# Altium schematic sheet Microcontroller.SchDoc: Microcontroller
size Tabloid; DocumentNumber: 2; Revision: 0.4b; SheetNumber: 2; SheetTotal: 11
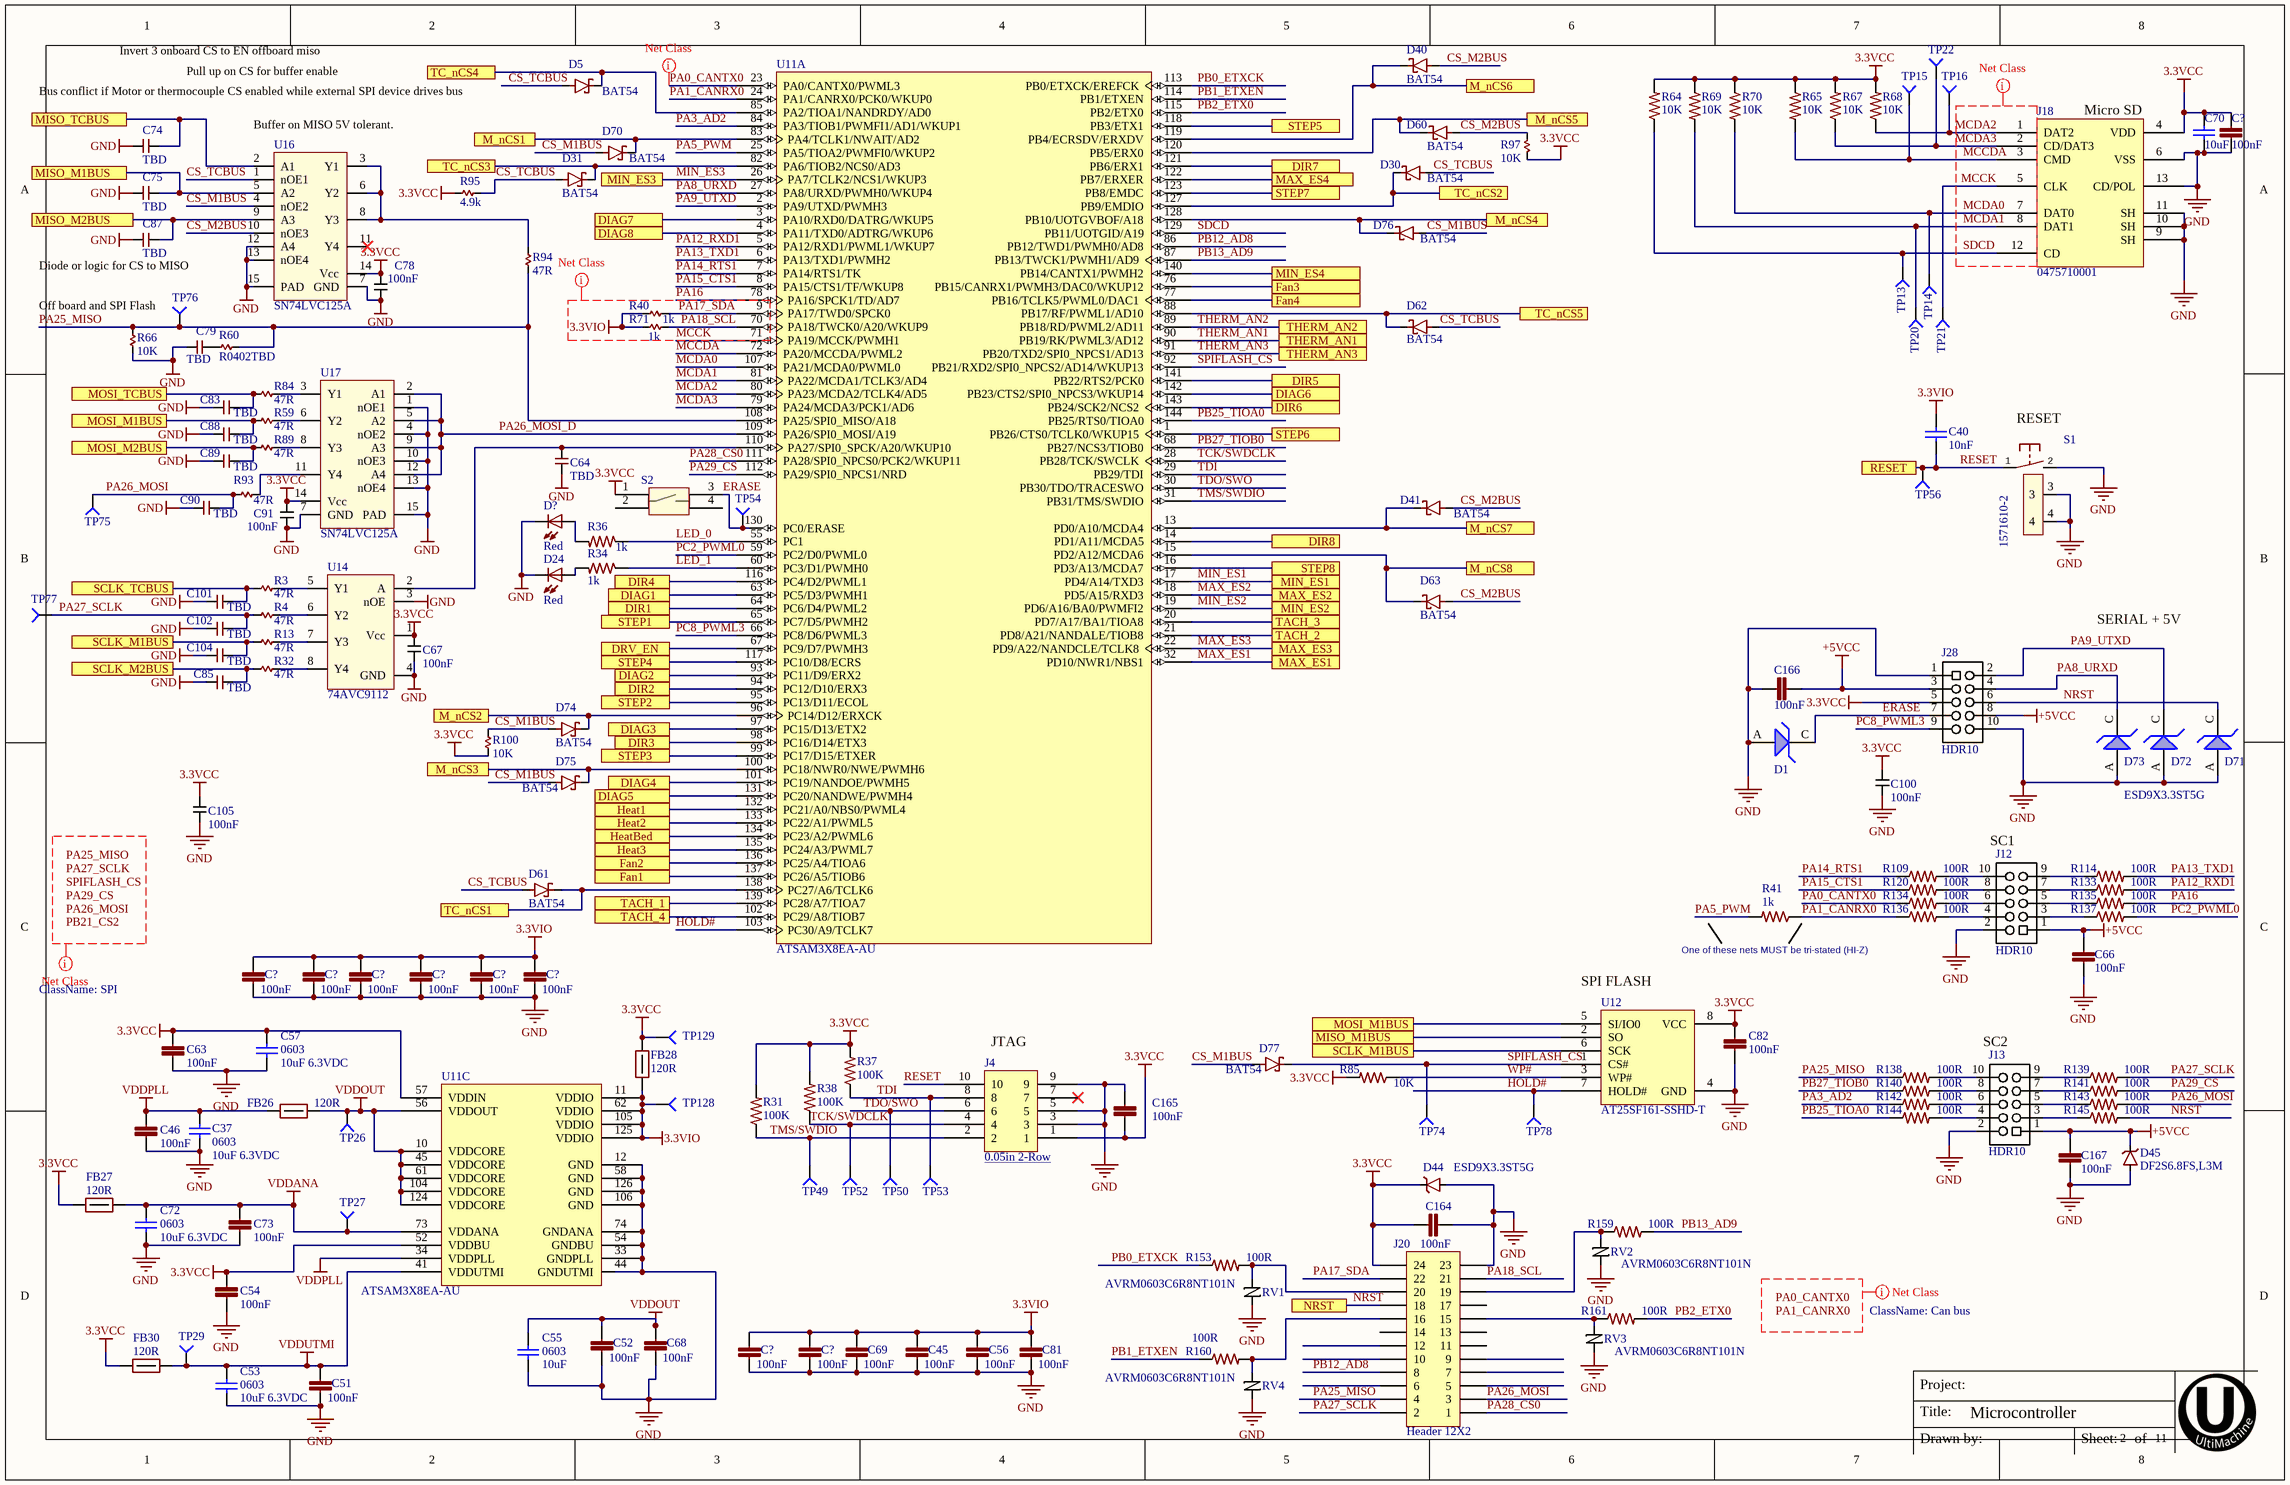
[diagram p0: Microcontroller.SchDoc]

## Parts
(Parts that share a designator on the sheet are numbered #1, #2 ... from top to bottom, then left to right.)
C37  0603  value 10uF 6.3VDC  [C0603]
C40  10nF  [C0402]
C45  100nF  [C0402]
C46  100nF  [C0402]
C51  100nF  [C0402]
C52  100nF  [C0402]
C53  0603  value 10uF 6.3VDC  [C0603]
C54  100nF  [C0402]
C55  0603  value 10uF  [C0603]
C56  100nF  [C0402]
C57  0603  value 10uF 6.3VDC  [C0603]
C63  100nF  [C0402]
C64  TBD  [C0402]
C66  100nF  [C0402]
C67  100nF  [C0201 Large Pads]
C68  100nF  [C0402]
C69  100nF  [C0402]
C70  value 10uF  [C0603]  (hidden comment: 0603)
C72  0603  value 10uF 6.3VDC  [C0603]
C73  100nF  [C0402]
C74  TBD  [C0402]
C75  TBD  [C0402]
C78  100nF  [C0201 Large Pads]
C79  TBD  [C0402]
C81  100nF  [C0402]
C82  100nF  [C0402]
C83  TBD  [C0402]
C85  TBD  [C0402]
C87  TBD  [C0402]
C88  TBD  [C0402]
C89  TBD  [C0402]
C90  TBD  [C0402]
C91  100nF  [C0201 Large Pads]
C100  100nF  [C0201 Large Pads]
C101  TBD  [C0402]
C102  TBD  [C0402]
C104  TBD  [C0402]
C105  100nF  [C0201 Large Pads]
C164  100nF  [C0402]
C165  100nF  [C0402]
C166  100nF  [C0402]
C167  100nF  [C0402]
C?#1  100nF  [C0402]
C?#2  100nF  [C0402]
C?#3  100nF  [C0402]
C?#4  100nF  [C0402]
C?#5  100nF  [C0402]
C?#6  100nF  [C0402]
C?#7  100nF  [C0402]
C?#8  100nF  [C0402]
C?#9  100nF  [C0402]
D1  ESD9X3.3ST5G  [SOD923-100X40-2N]  (value not drawn)
D5  BAT54  [SOD523_IPC]
D24  Red  [LED2012120]
D30  BAT54  [SOD523_IPC]
D31  BAT54  [SOD523_IPC]
D40  BAT54  [SOD523_IPC]
D41  BAT54  [SOD523_IPC]
D44  ESD9X3.3ST5G  [SOD923-D]
D45  DF2S6.8FS,L3M  [SOD923-D]
D60  BAT54  [SOD523_IPC]
D61  BAT54  [SOD523_IPC]
D62  BAT54  [SOD523_IPC]
D63  BAT54  [SOD523_IPC]
D70  BAT54  [SOD523_IPC]
D71  ESD9X3.3ST5G  [SOD923-100X40-2N]
D72  ESD9X3.3ST5G  [SOD923-100X40-2N]  (value not drawn)
D73  ESD9X3.3ST5G  [SOD923-100X40-2N]  (value not drawn)
D74  BAT54  [SOD523_IPC]
D75  BAT54  [SOD523_IPC]
D76  BAT54  [SOD523_IPC]
D77  BAT54  [SOD523_IPC]
D?  Red  [LED2012120]
FB26  120R  [FB0603]
FB27  120R  [FB0603]
FB28  120R  [FB0603]
FB30  120R  [FB0603]
J4  0.05in 2-Row  [FTSH-105-XX-X-DV]
J12  HDR10  [HDR2X5 IDC]
J13  HDR10  [HDR2X5 IDC]
J18  0475710001  [SD_MICRO 475710001]
J20  Header 12X2  [HDR2X12]
J28  HDR10  [HDR2X5 IDC]
R3  47R  [R0402]
R4  47R  [R0402]
R13  47R  [R0402]
R31  100K  [R0402]
R32  47R  [R0402]
R34  1k  [R0402]
R36  1k  [R0402]
R37  100K  [R0402]
R38  100K  [R0402]
R40  1k  [R0402]
R41  1k  [R0402]
R59  47R  [R0402]
R60  R0402TBD  [R0402]
R64  10K  [R0402]
R65  10K  [R0402]
R66  10K  [R0402]
R67  10K  [R0402]
R68  10K  [R0402]
R69  10K  [R0402]
R70  10K  [R0402]
R71  1k  [R0402]
R84  47R  [R0402]
R85  10K  [R0402]
R89  47R  [R0402]
R93  47R  [R0402]
R94  47R  [R0402]
R95  4.9k  [R0402]
R97  10K  [R0402]
R100  10K  [R0402]
R109  100R  [R0402]
R114  100R  [R0402]
R120  100R  [R0402]
R133  100R  [R0402]
R134  100R  [R0402]
R135  100R  [R0402]
R136  100R  [R0402]
R137  100R  [R0402]
R138  100R  [R0402]
R139  100R  [R0402]
R140  100R  [R0402]
R141  100R  [R0402]
R142  100R  [R0402]
R143  100R  [R0402]
R144  100R  [R0402]
R145  100R  [R0402]
R153  100R  [R0402]
R159  100R  [R0402]
R160  100R  [R0402]
R161  100R  [R0402]
RV1  AVRM0603C6R8NT101N  [C0201 Large Pads]
RV2  AVRM0603C6R8NT101N  [C0201 Large Pads]
RV3  AVRM0603C6R8NT101N  [C0201 Large Pads]
RV4  AVRM0603C6R8NT101N  [C0201 Large Pads]
S1  1571610-2  [B3F-31XX]
S2  KMR741NG ULC LFS  [KMR 6 Series]  (value not drawn)
TP13  TP4  [TP-2]  (value not drawn)  (no BOM)
TP14  TP4  [TP-2]  (value not drawn)  (no BOM)
TP15  TP4  [TP-2]  (value not drawn)  (no BOM)
TP16  TP4  [TP-2]  (value not drawn)  (no BOM)
TP20  TP4  [TP-2]  (value not drawn)  (no BOM)
TP21  TP4  [TP-2]  (value not drawn)  (no BOM)
TP22  TP4  [TP-2]  (value not drawn)  (no BOM)
TP26  TP4  [TP-2]  (value not drawn)  (no BOM)
TP27  TP4  [TP-2]  (value not drawn)  (no BOM)
TP29  TP4  [TP-2]  (value not drawn)  (no BOM)
TP49  TP4  [TP-2]  (value not drawn)  (no BOM)
TP50  TP4  [TP-2]  (value not drawn)  (no BOM)
TP52  TP4  [TP-2]  (value not drawn)  (no BOM)
TP53  TP4  [TP-2]  (value not drawn)  (no BOM)
TP54  TP4  [TP-2]  (value not drawn)  (no BOM)
TP56  TP4  [TP-2]  (value not drawn)  (no BOM)
TP74  TP4  [TP-2]  (value not drawn)  (no BOM)
TP75  TP4  [TP-2]  (value not drawn)  (no BOM)
TP76  TP4  [TP-2]  (value not drawn)  (no BOM)
TP77  TP4  [TP-2]  (value not drawn)  (no BOM)
TP78  TP4  [TP-2]  (value not drawn)  (no BOM)
TP128  TP4  [TP-2]  (value not drawn)  (no BOM)
TP129  TP4  [TP-2]  (value not drawn)  (no BOM)
U11#1  ATSAM3X8EA-AU  [LQFP144_N]  (part A of 3)
U11#2  ATSAM3X8EA-AU  [LQFP144_N]  (part C of 3)
U12  AT25SF161-SSHD-T  [S25FL216K0PMFI041]
U14  74AVC9112  [XSON50P100X50-8L]
U16  SN74LVC125A  [PVQFN14_3.5X3.5]
U17  SN74LVC125A  [PVQFN14_3.5X3.5]

## Ports
DIAG1, DIAG2, DIAG3, DIAG4, DIAG5, DIAG6, DIAG7, DIAG8, DIR1, DIR2, DIR3, DIR4, DIR5, DIR6, DIR7, DIR8, DRV_EN, Fan1, Fan2, Fan3, Fan4, Heat1, Heat2, Heat3, HeatBed, M_nCS1, M_nCS2, M_nCS3, M_nCS4, M_nCS5, M_nCS6, M_nCS7, M_nCS8, MAX_ES1, MAX_ES2, MAX_ES3, MAX_ES4, MIN_ES1, MIN_ES2, MIN_ES3, MIN_ES4, MISO_M1BUS, MISO_M2BUS, MISO_TCBUS, MOSI_M1BUS, MOSI_M2BUS, MOSI_TCBUS, NRST, RESET, SCLK_M1BUS, SCLK_M2BUS, SCLK_TCBUS, STEP1, STEP2, STEP3, STEP4, STEP5, STEP6, STEP7, STEP8, TACH_1, TACH_2, TACH_3, TACH_4, TC_nCS1, TC_nCS2, TC_nCS3, TC_nCS4, TC_nCS5, THERM_AN1, THERM_AN2, THERM_AN3

## Nets
3.3VCC: C54.1 C57.2 C63.1 C67.2 C70.2 C78.2 C82.1 C91.2 C100.2 C105.2 C164.1 C165.2 C?#1.1 D44.K FB27.1 FB28.2 FB30.1 J4.1 J18.4(VDD) J20.24 J28.5 R31.2 R37.2 R38.2 R64.2 R65.1 R67.2 R68.2 R69.1 R70.1 R85.2 R95.1 R97.1 R100.1 S2.1 TP129.1 U11#2.52(VDDBU) U11#2.57(VDDIN) U12.8(VCC) U14.1(Vcc) U16.14(Vcc) U17.14(Vcc)
3.3VIO: C40.2 C45.1 C56.1 C69.1 C81.1 C?#2.1 C?#3.1 C?#4.1 C?#5.1 C?#6.1 C?#7.1 C?#8.1 C?#9.1 FB28.1 R40.1 R71.1 TP128.1 U11#2.11(VDDIO) U11#2.62(VDDIO) U11#2.105(VDDIO) U11#2.125(VDDIO)
+5VCC: C66.2 C166.1 C167.2 D45.K J12.1 J13.1 J28.3 J28.8
GND: C37.1 C45.2 C46.2 C51.2 C52.2 C53.1 C54.2 C55.1 C56.2 C57.1 C63.2 C64.1 C66.1 C67.1 C68.2 C69.2 C70.1 C72.1 C73.2 C74.2 C75.2 C78.1 C79.2 C81.2 C82.2 C83.2 C85.1 C87.2 C88.2 C89.2 C90.2 C91.1 C100.1 C101.1 C102.1 C104.1 C105.1 C164.2 C165.1 C166.2 C167.1 C?#1.2 C?#2.2 C?#3.2 C?#4.2 C?#5.2 C?#6.2 C?#7.2 C?#8.2 C?#9.2 D1.A D24.C D44.A D45.A D71.A D72.A D73.A D?.C J4.3 J4.5 J4.9 J12.2 J13.2 J18.6(VSS) J18.9(SH) J18.10(SH) J18.11(SH) J18.13(CD/POL) J20.23 J28.1 J28.10 R66.1 RV1.2 RV2.2 RV3.2 RV4.2 S1.2(S) S1.3 S1.4 U11#2.12(GND) U11#2.33(GNDPLL) U11#2.44(GNDUTMI) U11#2.54(GNDBU) U11#2.58(GND) U11#2.74(GNDANA) U11#2.106(GND) U11#2.126(GND) U12.4(GND) U14.3(nOE) U14.4(GND) U16.7(GND) U16.12(A4) U16.13(nOE4) U16.15(PAD) U17.1(nOE1) U17.4(nOE2) U17.7(GND) U17.10(nOE3) U17.13(nOE4) U17.15(PAD)
VDDANA: C72.2 C73.1 FB27.2 TP27.1 U11#2.73(VDDANA)
VDDOUT: C52.1 C55.2 C68.1 FB26.2 TP26.1 U11#2.10(VDDCORE) U11#2.45(VDDCORE) U11#2.56(VDDOUT) U11#2.61(VDDCORE) U11#2.104(VDDCORE) U11#2.124(VDDCORE)
VDDPLL: C37.2 C46.1 FB26.1 U11#2.34(VDDPLL)
VDDUTMI: C51.1 C53.2 FB30.2 TP29.1 U11#2.41(VDDUTMI)
CS_M1BUS: D70.A D74.A D75.A D76.A D77.A R100.2 U16.4(nOE2)
CS_M2BUS: D40.A D41.A D60.A D63.A R97.2 U16.10(nOE3)
CS_TCBUS: D5.A D30.A D31.A D61.A D62.A R95.2 U16.1(nOE1)
DIAG1: U11#1.63(PC5/D3/PWMH1) ; port DIAG1
DIAG2: U11#1.93(PC11/D9/ERX2) ; port DIAG2
DIAG3: U11#1.97(PC15/D13/ETX2) ; port DIAG3
DIAG4: U11#1.101(PC19/NANDOE/PWMH5) ; port DIAG4
DIAG5: U11#1.131(PC20/NANDWE/PWMH4) ; port DIAG5
DIAG6: U11#1.142(PB23/CTS2/SPI0_NPCS3/WKUP14) ; port DIAG6
DIAG7: U11#1.3(PA10/RXD0/DATRG/WKUP5) ; port DIAG7
DIAG8: U11#1.4(PA11/TXD0/ADTRG/WKUP6) ; port DIAG8
DIR1: U11#1.64(PC6/D4/PWML2) ; port DIR1
DIR2: U11#1.94(PC12/D10/ERX3) ; port DIR2
DIR3: U11#1.98(PC16/D14/ETX3) ; port DIR3
DIR4: U11#1.116(PC4/D2/PWML1) ; port DIR4
DIR5: U11#1.141(PB22/RTS2/PCK0) ; port DIR5
DIR6: U11#1.143(PB24/SCK2/NCS2) ; port DIR6
DIR7: U11#1.121(PB6/ERX1) ; port DIR7
DIR8: U11#1.14(PD1/A11/MCDA5) ; port DIR8
DRV_EN: U11#1.67(PC9/D7/PWMH3) ; port DRV_EN
ERASE: D1.C J28.7 S2.3 TP54.1 U11#1.130(PC0/ERASE)
Fan1: U11#1.137(PC26/A5/TIOB6) ; port Fan1
Fan2: U11#1.136(PC25/A4/TIOA6) ; port Fan2
Fan3: U11#1.76(PB15/CANRX1/PWMH3/DAC0/WKUP12) ; port Fan3
Fan4: U11#1.77(PB16/TCLK5/PWML0/DAC1) ; port Fan4
Heat1: U11#1.132(PC21/A0/NBS0/PWML4) ; port Heat1
Heat2: U11#1.133(PC22/A1/PWML5) ; port Heat2
Heat3: U11#1.135(PC24/A3/PWML7) ; port Heat3
HeatBed: U11#1.134(PC23/A2/PWML6) ; port HeatBed
HOLD#: TP78.1 U11#1.103(PC30/A9/TCLK7) U12.7(HOLD#)
LED_0: R36.1 U11#1.55(PC1)
LED_1: R34.1 U11#1.60(PC3/D1/PWMH0)
M_nCS1: D70.K U11#1.83(PA4/TCLK1/NWAIT/AD2) ; port M_nCS1
M_nCS2: D74.K U11#1.96(PC14/D12/ERXCK) ; port M_nCS2
M_nCS3: D75.K U11#1.100(PC18/NWR0/NWE/PWMH6) ; port M_nCS3
M_nCS4: D76.K U11#1.128(PB10/UOTGVBOF/A18) ; port M_nCS4
M_nCS5: D60.K U11#1.120(PB5/ERX0) ; port M_nCS5
M_nCS6: D40.K U11#1.119(PB4/ECRSDV/ERXDV) ; port M_nCS6
M_nCS7: D41.K U11#1.13(PD0/A10/MCDA4) ; port M_nCS7
M_nCS8: D63.K U11#1.15(PD2/A12/MCDA6) ; port M_nCS8
MAX_ES1: U11#1.32(PD10/NWR1/NBS1) ; port MAX_ES1
MAX_ES2: U11#1.18(PD5/A15/RXD3) ; port MAX_ES2
MAX_ES3: U11#1.22(PD9/A22/NANDCLE/TCLK8) ; port MAX_ES3
MAX_ES4: U11#1.122(PB7/ERXER) ; port MAX_ES4
MCCDA: J18.3(CMD) R65.2 TP15.1 U11#1.72(PA20/MCCDA/PWML2)
MCCK: J18.5(CLK) TP21.1 U11#1.71(PA19/MCCK/PWMH1)
MCDA0: J18.7(DAT0) R70.2 TP14.1 U11#1.107(PA21/MCDA0/PWML0)
MCDA1: J18.8(DAT1) R69.2 TP20.1 U11#1.81(PA22/MCDA1/TCLK3/AD4)
MCDA2: J18.1(DAT2) R68.1 TP16.1 U11#1.80(PA23/MCDA2/TCLK4/AD5)
MCDA3: J18.2(CD/DAT3) R67.1 TP22.1 U11#1.79(PA24/MCDA3/PCK1/AD6)
MIN_ES1: U11#1.17(PD4/A14/TXD3) ; port MIN_ES1
MIN_ES2: U11#1.19(PD6/A16/BA0/PWMFI2) ; port MIN_ES2
MIN_ES3: U11#1.26(PA7/TCLK2/NCS1/WKUP3) ; port MIN_ES3
MIN_ES4: U11#1.140(PB14/CANTX1/PWMH2) ; port MIN_ES4
MISO_M1BUS: C75.1 U12.2(SO) U16.5(A2) ; port MISO_M1BUS
MISO_M2BUS: C87.1 U16.9(A3) ; port MISO_M2BUS
MISO_TCBUS: C74.1 U16.2(A1) ; port MISO_TCBUS
MOSI_M1BUS: C88.1 R59.1 U12.5(SI/IO0) ; port MOSI_M1BUS
MOSI_M2BUS: C89.1 R89.1 ; port MOSI_M2BUS
MOSI_TCBUS: C83.1 R84.1 ; port MOSI_TCBUS
NRST: D71.C J20.18 J28.6 R145.2 ; port NRST
PA0_CANTX0: R134.1 U11#1.23(PA0/CANTX0/PWML3)
PA1_CANRX0: R41.1 R136.1 U11#1.24(PA1/CANRX0/PCK0/WKUP0)
PA3_AD2: R142.1 U11#1.84(PA3/TIOB1/PWMFI1/AD1/WKUP1)
PA5_PWM: R41.2 U11#1.25(PA5/TIOA2/PWMFI0/WKUP2)
PA8_URXD: D73.C J28.4 U11#1.27(PA8/URXD/PWMH0/WKUP4)
PA9_UTXD: D72.C J28.2 U11#1.2(PA9/UTXD/PWMH3)
PA12_RXD1: R133.2 U11#1.5(PA12/RXD1/PWML1/WKUP7)
PA13_TXD1: R114.2 U11#1.6(PA13/TXD1/PWMH2)
PA14_RTS1: R109.1 U11#1.7(PA14/RTS1/TK)
PA15_CTS1: R120.1 U11#1.8(PA15/CTS1/TF/WKUP8)
PA16: R135.2 U11#1.78(PA16/SPCK1/TD/AD7)
PA17_SDA: J20.22 R40.2 U11#1.9(PA17/TWD0/SPCK0)
PA18_SCL: J20.21 R71.2 U11#1.70(PA18/TWCK0/A20/WKUP9)
PA25_MISO: J20.4 R60.2 R66.2 R94.1 R138.1 TP76.1 U11#1.108(PA25/SPI0_MISO/A18)
PA26_MOSI: C90.1 J20.3 R93.1 R143.2 TP75.1
PA26_MOSI_D: U11#1.109(PA26/SPI0_MOSI/A19) U17.2(A1) U17.5(A2) U17.9(A3) U17.12(A4)
PA27_SCLK: C102.2 J20.2 R4.1 R139.2 TP77.1
PA28_CS0: J20.1 U11#1.111(PA28/SPI0_NPCS0/PCK2/WKUP11)
PA29_CS: R141.2 U11#1.112(PA29/SPI0_NPCS1/NRD)
PB0_ETXCK: R153.1 U11#1.113(PB0/ETXCK/EREFCK)
PB1_ETXEN: R160.1 U11#1.114(PB1/ETXEN)
PB2_ETX0: R161.2 U11#1.115(PB2/ETX0)
PB12_AD8: J20.8 U11#1.86(PB12/TWD1/PWMH0/AD8)
PB13_AD9: R159.2 U11#1.87(PB13/TWCK1/PWMH1/AD9)
PB25_TIOA0: R144.1 U11#1.144(PB25/RTS0/TIOA0)
PB27_TIOB0: R140.1 U11#1.68(PB27/NCS3/TIOB0)
PC2_PWML0: R137.2 U11#1.59(PC2/D0/PWML0)
PC8_PWML3: J28.9 U11#1.66(PC8/D6/PWML3)
RESET: C40.1 J4.10 S1.1(P) TP56.1 ; port RESET
SCLK_M1BUS: C104.2 R13.1 U12.6(SCK) ; port SCLK_M1BUS
SCLK_M2BUS: C85.2 R32.1 ; port SCLK_M2BUS
SCLK_TCBUS: C101.2 R3.1 ; port SCLK_TCBUS
SDCD: J18.12(CD) R64.1 TP13.1 U11#1.129(PB11/UOTGID/A19)
SPIFLASH_CS: D77.K TP74.1 U11#1.92(PB21/RXD2/SPI0_NPCS2/AD14/WKUP13) U12.1(CS#)
STEP1: U11#1.65(PC7/D5/PWMH2) ; port STEP1
STEP2: U11#1.95(PC13/D11/ECOL) ; port STEP2
STEP3: U11#1.99(PC17/D15/ETXER) ; port STEP3
STEP4: U11#1.117(PC10/D8/ECRS) ; port STEP4
STEP5: U11#1.118(PB3/ETX1) ; port STEP5
STEP6: U11#1.1(PB26/CTS0/TCLK0/WKUP15) ; port STEP6
STEP7: U11#1.123(PB8/EMDC) ; port STEP7
STEP8: U11#1.16(PD3/A13/MCDA7) ; port STEP8
TACH_1: U11#1.139(PC28/A7/TIOA7) ; port TACH_1
TACH_2: U11#1.21(PD8/A21/NANDALE/TIOB8) ; port TACH_2
TACH_3: U11#1.20(PD7/A17/BA1/TIOA8) ; port TACH_3
TACH_4: U11#1.102(PC29/A8/TIOB7) ; port TACH_4
TC_nCS1: D61.K U11#1.138(PC27/A6/TCLK6) ; port TC_nCS1
TC_nCS2: D30.K U11#1.127(PB9/EMDIO) ; port TC_nCS2
TC_nCS3: D31.K U11#1.82(PA6/TIOB2/NCS0/AD3) ; port TC_nCS3
TC_nCS4: D5.K U11#1.85(PA2/TIOA1/NANDRDY/AD0) ; port TC_nCS4
TC_nCS5: D62.K U11#1.88(PB17/RF/PWML1/AD10) ; port TC_nCS5
TCK/SWDCLK: J4.4 R38.1 TP52.1 U11#1.28(PB28/TCK/SWCLK)
TDI: J4.8 R37.1 TP53.1 U11#1.29(PB29/TDI)
TDO/SWO: J4.6 TP50.1 U11#1.30(PB30/TDO/TRACESWO)
THERM_AN1: U11#1.90(PB19/RK/PWML3/AD12) ; port THERM_AN1
THERM_AN2: U11#1.89(PB18/RD/PWML2/AD11) ; port THERM_AN2
THERM_AN3: U11#1.91(PB20/TXD2/SPI0_NPCS1/AD13) ; port THERM_AN3
TMS/SWDIO: J4.2 R31.1 TP49.1 U11#1.31(PB31/TMS/SWDIO)
WP#: R85.1 U12.3(WP#)
NetC64_2: C64.2 U11#1.110(PA27/SPI0_SPCK/A20/WKUP10) U14.2(A)
NetC79_1: C79.1 R60.1
NetD24_A: D24.A R34.2
NetD?_A: D?.A R36.2
NetJ12_3: J12.3 R137.1
NetJ12_4: J12.4 R136.2
NetJ12_5: J12.5 R135.1
NetJ12_6: J12.6 R134.2
NetJ12_7: J12.7 R133.1
NetJ12_8: J12.8 R120.2
NetJ12_9: J12.9 R114.1
NetJ12_10: J12.10 R109.2
NetJ13_3: J13.3 R145.1
NetJ13_4: J13.4 R144.2
NetJ13_5: J13.5 R143.1
NetJ13_6: J13.6 R142.2
NetJ13_7: J13.7 R141.1
NetJ13_8: J13.8 R140.2
NetJ13_9: J13.9 R139.1
NetJ13_10: J13.10 R138.2
NetJ20_15: J20.15 R161.1 RV3.1
NetJ20_16: J20.16 R160.2 RV4.1
NetJ20_19: J20.19 R159.1 RV2.1
NetJ20_20: J20.20 R153.2 RV1.1
NetR3_2: R3.2 U14.5(Y1)
NetR4_2: R4.2 U14.6(Y2)
NetR13_2: R13.2 U14.7(Y3)
NetR32_2: R32.2 U14.8(Y4)
NetR59_2: R59.2 U17.6(Y2)
NetR84_2: R84.2 U17.3(Y1)
NetR89_2: R89.2 U17.8(Y3)
NetR93_2: R93.2 U17.11(Y4)
NetR94_2: R94.2 U16.3(Y1) U16.6(Y2) U16.8(Y3)

Not connected (* = marked no-connect by the designer): J4 7*; J20 5 6 7 9 10 11 12 13 14 17; S2 2 4; U14 23(NC); U16 11(Y4)* 23(NC); U17 23(NC)

## Layout directives
net class SD: MCCDA, MCCK, MCDA0, MCDA1, SDCD
net class Can bus: PA0_CANTX0, PA1_CANRX0
net class SPI: PA25_MISO, PA26_MOSI, PA27_SCLK, PA29_CS, PB21_CS2, SPIFLASH_CS
net class SERIAL: 3.3VIO, MCCK, PA16, PA17_SDA, PA18_SCL
net class CANBUS: PA0_CANTX0

## Notes on the sheet
- (near D5) Bus conflict if Motor or thermocouple CS enabled while external SPI device drives bus
- Invert 3 onboard CS to EN offboard miso
- Pull up on CS for buffer enable
- (near U16) Buffer on MISO 5V tolerant.
- (near J18) Micro SD
- (near C87) Diode or logic for CS to MISO
- (near TP76) Off board and SPI Flash
- (near S1) RESET
- SERIAL + 5V
- (near J12) SC1
- One of these nets MUST be tri-stated (HI-Z)
- (near U12) SPI FLASH
- (near J4) JTAG
- (near J13) SC2
- Labels drawn without touching a wire or pin: PA0_CANTX0, PA1_CANRX0, PA25_MISO, PA26_MOSI, PA27_SCLK, PA29_CS, PB21_CS2, SPIFLASH_CS
- Title:
- Project:
- Drawn by:
- Sheet:
- of

## Library data of the parts
C37 C53 C55 C57 C70 C72 = C1608JB0J106K080AB: CAP CER 10UF 6.3V 10% JB 0603; MANUFACTURER: TDK; EE_SPEC: 6.3VDC; PART DESCRIPTION: CAP CER 10UF 6.3V 10% JB 0603; TOLERANCE: 10%; MANUFACTURER #: C1608JB0J106K080AB; DISTRIBUTOR #: 445-11185-1-ND; DISTRIBUTOR: Digi-Key Electronics; PART: C1608JB0J106K080AB
C40 = GRM155R71H103JA88D: CAP CER 10nF 50V X7R 0402; PART DESCRIPTION: 10000pF ±5% 50V Ceramic Capacitor X7R 0402 (1005 Metric); MANUFACTURER: Murata; TOLERANCE: 5%; EE_SPEC: 50V; VALUE: 10nF; MANUFACTURER #: GRM155R71H103JA88D; DISTRIBUTOR #: 490-7763-1-ND; DISTRIBUTOR: Digi-Key Electronics; PART: GRM155R71H103JA88D
C45 C46 C51 C52 C54 C56 C63 C66 C68 C69 C73 C81 C82 C164-C167 C?#1-C?#9 = GRM155R71C104KA88D: CAP CER 0402 100nF 16V 10% X7R; MANUFACTURER: Murata; PART DESCRIPTION: 0.10µF ±10% 16V Ceramic Capacitor X7R 0402 (1005 Metric); EE_SPEC: 100nF 16V X7R 0402; VALUE: 100nF; MANUFACTURER #: GRM155R71C104KA88D; DISTRIBUTOR #: 490-3261-2-ND; DISTRIBUTOR: Digi-Key Electronics; PART: GRM155R71C104KA88D; TOLERANCE: 10%
C64 C74 C75 C79 C83 C85 C87-C90 C101 C102 C104 = C0402_TBD: CAP CER 0402 TBD; MANUFACTURER: TBD; VALUE: TBD; MANUFACTURER #: TBD; DISTRIBUTOR #: TBD; PART: TBD; PART DESCRIPTION: TBD; EE_SPEC: TBD
C67 C78 C91 = 100nF 6.3V X5R 0201: CAP CER 0.1UF 6.3V 10% X5R 0201; MANUFACTURER: Samsung; MANUFACTURER #: CL03A104KQ3NNNC; VALUE: 100nF; DISTRIBUTOR: DIGI-KEY; DISTRIBUTOR #: 1276-1013-1-ND; TOLERANCE: 10%; VOLTAGE: 6.3V; PART: CL03A104KQ3NNNC
C100 C105 = 100nF 6.3V X5R 0201: CAP CER 0.1UF 6.3V 10% X5R 0201; PART: CL03A104KQ3NNNC; MANUFACTURER: Samsung; MANUFACTURER #: CL03A104KQ3NNNC; DISTRIBUTOR: DIGI-KEY; DISTRIBUTOR #: 1276-1013-1-ND; TOLERANCE: 10%; VOLTAGE: 6.3V
D1 D44 D71-D73 = ESD9X3.3ST5G: TVS DIODE 3.3VWM 10.4VC SOD923; MANUFACTURER: On Semi; PART DESCRIPTION: TVS DIODE 3.3VWM SOD923; TOLERANCE: -NA-; VALUE: 3.3V; EE_SPEC: 3.3Vso 15pF; MANUFACTURER #: ESD9X3.3ST5G; DISTRIBUTOR #: ESD9X3.3ST5GOSCT-ND; PART: ESD9X3.3ST5G
  D1 D71-D73: DISTRIBUTOR: Digi-Key Electronics
  D44: DISTRIBUTOR: Digikey
D5 D30 D31 D40 D41 D60-D63 D70 D74-D77 = BAT54WX: DIODE SCHOTTKY 30V 200MA SOD523; MANUFACTURER: Diodes Incorporated; MANUFACTURER #: BAT54WX-TP; PART DESCRIPTION: Diode Schottky 30V 200mA (DC) Surface Mount SOD-523; TOLERANCE: -NA-; VALUE: BAT54; DISTRIBUTOR #: BAT54WX-TPTR-ND; DISTRIBUTOR: Digi-Key Electronics; PART: BAT54WX-TP; EE_SPEC: 30V 200mA
D24 D? = 5988110107F: LED 0805 Red; MANUFACTURER: Dialight; PART DESCRIPTION: Red 635nm LED Indication - Discrete 2.2V 0805 (2012 Metric); TOLERANCE: -NA-; EE_SPEC: Vf=2.2V; VALUE: Red; MANUFACTURER #: 5988110107F; DISTRIBUTOR #: 350-2038-2-ND; DISTRIBUTOR: Digi-Key Electronics; PART: 5988110107F
D45 = DF2S6.8FS,L3M: TVS DIODE 5V 9V SOD923; MANUFACTURER: Toshiba; EE_SPEC: 5Vso; MANUFACTURER #: DF2S6.8FS,L3M; PART DESCRIPTION: TVS DIODE 5V 9V SOD923; VALUE: 5V; PART: DF2S6.8FS,L3M
FB26-FB28 FB30 = FERRITE 120R 3A 0603: FERRITE BEAD 120 OHM 0603 1LN; MANUFACTURER: Samsung; MANUFACTURER #: CIS10P121AC; MANUFACTURER2#: 490-5254-2-ND; VALUE: 120Rfb; TOLERANCE: -NA-; EE_SPEC: 3A; DISTRIBUTOR #: 1276-6351-2-ND; DISTRIBUTOR: Digi-Key Electronics; PART: CIS10P121AC; PART DESCRIPTION: FERRITE BEAD 120 OHM 0603 1LN
J4 = ARM Cortex JTAG-DEBUG Header: 20021121-00010C4LF; MANUFACTURER: Amphenol FCI; PART DESCRIPTION: 10 Positions Header, Unshrouded Connector 0.050" (1.27mm) Surface Mount Gold; TOLERANCE: -NA-; VALUE: HDR10; MANUFACTURER #: 20021121-00010C4LF; DISTRIBUTOR #: 609-3695-2-ND; DISTRIBUTOR: Digi-Key Electronics; PART: 20021121-00010C4LF; EE_SPEC: -NA-
J12 J13 J28 = Header 10PIN 2ROW T-HOLE VERT SHROUDED: CONN HEADER VERT 10POS GOLD; MANUFACTURER #: 302-S101; MANUFACTURER: On Shore; PART DESCRIPTION: 10 Positions Header Connector 0.100" (2.54mm) Through Hole Gold; TOLERANCE: -NA-; DISTRIBUTOR #: ED1543-ND; DISTRIBUTOR: Digikey; PART: 302-S101; VALUE: HDR10; EE_SPEC: -NA-
J18 = 0475710001: microSD 0475710001Molex Part; MANUFACTURER: Molex; PART DESCRIPTION: 10 (8 + 2) Position Card Connector Secure Digital - microSD™ Surface Mount, Right Angle Gold; TOLERANCE: -NA-; VALUE: SD Conn; MANUFACTURER #: 0475710001; DISTRIBUTOR #: WM9731TR-ND; DISTRIBUTOR: Digikey; PART: 0475710001; EE_SPEC: -NA-
J20 = Header 12X2: Header, 12-Pin, Dual row; MANUFACTURER #: 2213S-24G; MANUFACTURER: Multicomp; PART DESCRIPTION: Board-To-Board Connector, 2.54 mm, 24 Contacts, Header, 2213S Series, Through Hole, 2 Rows; TOLERANCE: -NA-; VALUE: HDR24; DISTRIBUTOR #: 08N6796; DISTRIBUTOR: Future; PART: 2213S-24G; EE_SPEC: -NA-
R3 R4 R13 R32 R59 R84 R89 R93 R94 = 47R 1% 0402: RES 47 OHM 1% 1/16W 0402; MANUFACTURER: Vishay Dale; MANUFACTURER #: CRCW040247R0FKEDC; Part Description: 47 Ohms ±1% 0.063W, 1/16W Chip Resistor 0402 (1005 Metric)  Thick Film; Tolerance: +/- 1%; VALUE: 47R; EE_SPEC: 47R 1% 0402; PART: CRCW040247R0FKEDC
R31 R37 R38 = RC1005F104CS: RES SMD 100K OHM 1% 1/16W 0402; MANUFACTURER: Samsung; PART DESCRIPTION: 100k Ohm ±1% 0.063W, 1/16W Chip Resistor 0402 (1005 Metric) Moisture Resistant Thick Film; VALUE: 100K; MANUFACTURER #: RC1005F104CS; DISTRIBUTOR #: 1276-3432-1-ND; DISTRIBUTOR: Digi-Key Electronics; PART: RC1005F104CS; TOLERANCE: 1%; EE_SPEC: 1/16W
R34 R36 R41 = RK73H1ETTP1001F: RES 0402 1k 63mW 1%; MANUFACTURER: Yageo; MANUFACTURER #: RC0402FR-071KL; PART DESCRIPTION: 1k Ohm ±1% 0.063W, 1/16W Chip Resistor 0402 (1005 Metric) Moisture Resistant Thick Film; EE_SPEC: 1/16W; VALUE: 1k; DISTRIBUTOR #: 311-1.00KLRTR-ND; DISTRIBUTOR: Digi-Key Electronics; PART: RC0402FR-071KL; TOLERANCE: 1%
R40 R71 = 1k 1% 0402: RES 0402 1k 63mW 1%; MANUFACTURER: Yageo; MANUFACTURER #: RC0402FR-071KL; PART DESCRIPTION: 1k Ohm ±1% 0.063W, 1/16W Chip Resistor 0402 (1005 Metric) Moisture Resistant Thick Film; EE_SPEC: 1/16W; DISTRIBUTOR #: 311-1.00KLRTR-ND; DISTRIBUTOR: Digi-Key Electronics; PART: RC0402FR-071KL; TOLERANCE: 1%; VALUE: 1k
R60 = R0402TBD: Resistor; MANUFACTURER #: DNI-R0402TBD; PART: DNI-R0402TBD; DNI: DNI; VALUE: R0402TBD
R64 R65 R67-R70 R85 = RC0402FR-0710KP: RES SMD 10K OHM 1% 1/16W 0402; MANUFACTURER: Yageo; PART DESCRIPTION: 10k Ohm ±1% 0.063W, 1/16W Chip Resistor 0402 (1005 Metric) Moisture Resistant Thick Film; VALUE: 10K; MANUFACTURER #: RC0402FR-0710KP; DISTRIBUTOR #: YAG1249TR-ND; DISTRIBUTOR: Digi-Key Electronics; PART: RC0402FR-0710KP; TOLERANCE: 1%; EE_SPEC: 1/16W
R66 R95 R97 R100 = 10k 1% 0402: RES SMD 10K OHM 1% 1/16W 0402; MANUFACTURER: Yageo; MANUFACTURER #: RC0402FR-0710KP; PART DESCRIPTION: 10k Ohm ±1% 0.063W, 1/16W Chip Resistor 0402 (1005 Metric) Moisture Resistant Thick Film; DISTRIBUTOR #: YAG1249TR-ND; DISTRIBUTOR: Digikey; PART: RC0402FR-0710KP; TOLERANCE: 1%; EE_SPEC: 1/16W
  R66 R97 R100: VALUE: 10K
  R95: VALUE: 4.9k
R109 R114 R120 R133-R145 R153 R159-R161 = RES 100R 0402 1%: RES SMD 100 OHM 1% 1/16W 0402; MANUFACTURER: Yageo; MANUFACTURER #: RC0402FR-07100RL; PART DESCRIPTION: 100 Ohm ±1% 0.063W, 1/16W Chip Resistor 0402 (1005 Metric) Moisture Resistant Thick Film; VALUE: 100R; DISTRIBUTOR #: 311-100LRTR-ND; DISTRIBUTOR: Digi-Key Electronics; PART: RC0402FR-07100RL; TOLERANCE: 1%; EE_SPEC: 1/16W
RV1-RV4 = AVRM0603C6R8NT101N: VARISTOR 6.8V 10A 0201; MANUFACTURER: TDK; TOLERANCE: -NA-; EE_SPEC: 3.5Vso 100pF; MANUFACTURER #: AVRM0603C6R8NT101N; PART DESCRIPTION: VARISTOR 6.8V 10A 0201; VALUE: 6.8V; PART: AVRM0603C6R8NT101N
S1 = 1571610-2: SWTCH Momentary Washable; MANUFACTURER: TE; PART DESCRIPTION: Tactile Switches R/A SEALED TACT SWITCH; TOLERANCE: -NA-; VALUE: -NA-; EE_SPEC: 24V; MANUFACTURER #: 1571610-2; DISTRIBUTOR #: 506-1571610-2; DISTRIBUTOR: Mouser; PART: 1571610-2
S2 = KMR741NG ULC LFS: SWITCH TACTILE SPST-NO 0.05A 12V; MANUFACTURER: C&K; PART DESCRIPTION: Tactile Switch SPST-NO Top Actuated Surface Mount; TOLERANCE: -NA-; VALUE: -NA-; EE_SPEC: 32V 50mA; MANUFACTURER #: KMR741NG ULC LFS; DISTRIBUTOR #: CKN10688TR-ND; DISTRIBUTOR: Digi-Key Electronics; PART: KMR741NG ULC LFS
TP13-TP16 TP20-TP22 TP26 TP27 TP29 TP49 TP50 TP52-TP54 TP56 TP74-TP78 TP128 TP129 = Socket: MANUFACTURER #: NOTAPART-Testpoint; PART: NOTAPART-Testpoint
U11#1 U11#2 = ATML-ATSAM3X-LQFP-144: Atmel; PART DESCRIPTION: ARM® Cortex®-M3 SAM3X Microcontroller IC 32-Bit 84MHz 512KB (512K x 8) FLASH 144-LQFP (20x20); TOLERANCE: -NA-; VALUE: -NA-; EE_SPEC: 3.3V; MANUFACTURER #: ATSAM3X8EA-AU; MANUFACTURER: Atmel; DISTRIBUTOR #: ATSAM3X8EA-AU-ND; DISTRIBUTOR: Digi-Key Electronics; PART: ATSAM3X8EA-AU
U12 = AT25SF161-SSHD-T: IC FLASH 16M SPI 104MHZ 8SOIC; MANUFACTURER: Adesto; TOLERANCE: -NA-; VALUE: 16Mb; EE_SPEC: 3.3V; MANUFACTURER #: AT25SF161-SSHD-T; PART DESCRIPTION: IC FLASH 16M SPI 104MHZ 8SOIC; PART: AT25SF161-SSHD-T
U14 = 74AVC9112: Clock Fanout Buffer (Distribution) IC 1:4  8-XFDFN; MANUFACTURER #: 74AVC9112GTX; MANUFACTURER: Nexperia; TOLERANCE: -NA-; EE_SPEC: Clock Buffer 1:4 3.6V; DISTRIBUTOR #: 296-4708-2-ND; DISTRIBUTOR: Digikey; PART: 74AVC9112GTX; PART DESCRIPTION: Clock Fanout Buffer (Distribution) IC 1:4  8-XFDFN; VALUE: 74AVC9112
U16 U17 = SN74LVC125A: IC BUS BUFF TRI-ST QD 14VQFN; MANUFACTURER #: SN74LVC125ARGYR; MANUFACTURER: TI; PART DESCRIPTION: Buffer, Non-Inverting 4 Element 1 Bit per Element Push-Pull Output 14-VQFN (3.5x3.5); TOLERANCE: -NA-; EE_SPEC: 1.65-3.6Vcc, 5V tolerant inputs; DISTRIBUTOR #: 296-13961-2-ND; DISTRIBUTOR: Digikey; PART: SN74LVC125ARGYR; VALUE: SN74LVC125A